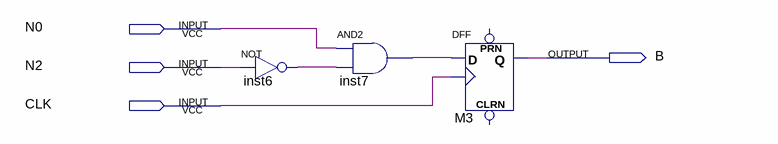
[diagram p0: schematic sheet]
// Quartus schematic maquina_3.bdf as structural Verilog: 3 symbols, 4 pins
module maquina_3 (
  input  N0,
  input  N2,
  input  CLK,
  output B
);

  wire inst6_out, inst7_out;

  not inst6 (inst6_out, N2);
  and inst7 (inst7_out, N0, inst6_out);
  DFF M3 (.CLK(CLK), .D(inst7_out), .Q(B));  // open: CLRN, PRN
endmodule
